# EasyEDA Pro project ChassisSupply_v1_0_2.eprj

# Schematic Schematic1
Board Name: Board1; Create Date: 2025-05-16; Page Name: P1; Project Name: ChassisSupply; Schematic Name: Schematic1; Update Date: 2025-05-17; Company: 嘉立创EDA; Drawed: 王大智; Page Size: A4; Version: V1.0
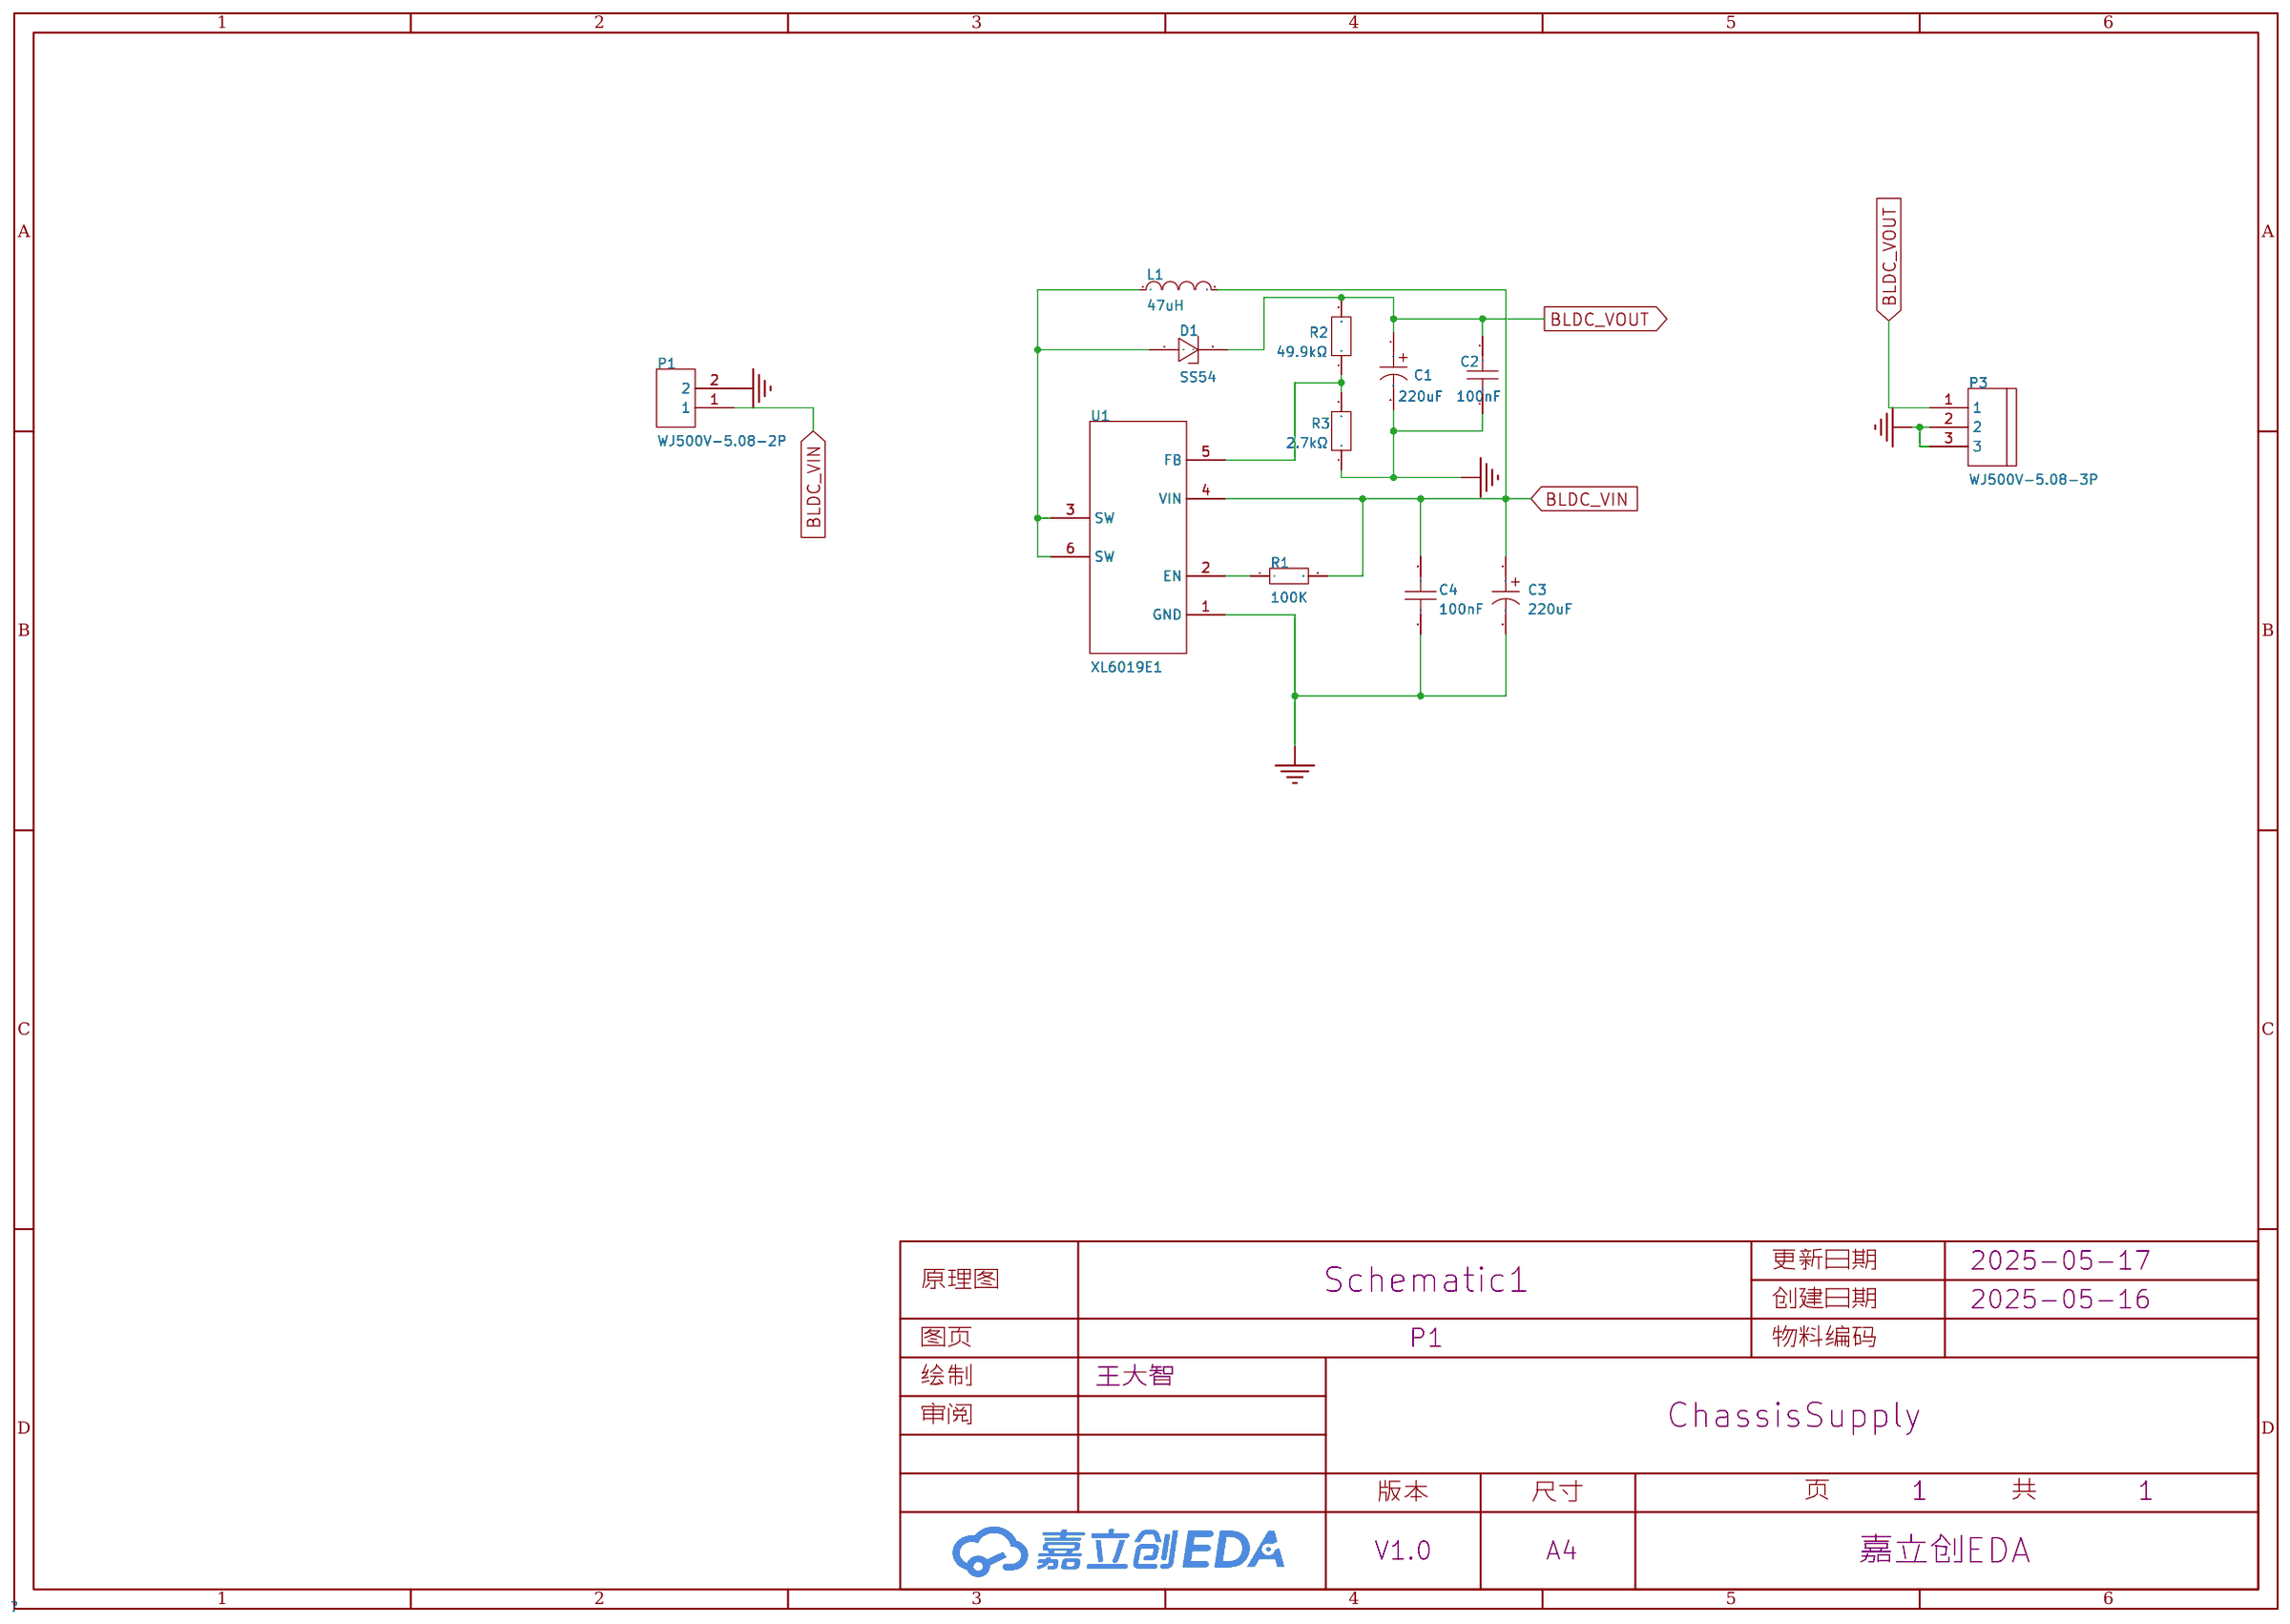
[diagram p0: schematic sheet]

## Parts
C1  220uF  [CAP-SMD_BD8.0-L8.3-W8.3-FD]
C2  100nF  [C0603]
C3  220uF  [CAP-SMD_BD8.0-L8.3-W8.3-FD]
C4  100nF  [C0603]
D1  SS54  [SMA_L4.3-W2.6-LS5.0-FD]
L1  47uH  [IND-SMD_L11.5-W10.0_SMMS1040]
P1  WJ500V-5.08-2P  [CONN-TH_2P-P5.00_WJ500V-5.08-2P]
P3  WJ500V-5.08-3P  [CONN-TH_3P-P5.00_WJ500V-5.08-3P]
R1  100K  [R0603]
R2  49.9kΩ  [R0603]
R3  2.7kΩ  [R0603]
U1  XL6019E1  [TO-263-5_L10.2-W9.9-P1.70-LS14.4-TL]

## Library data of the parts
C1 C3 = GVT1V227M0810CNVC: 容值:220uF;精度:±20%;额定电压:35V;纹波电流:175mA@120Hz;; LCSC Part Name: 220uF ±20% 35V; Supplier Part: C2983323; Manufacturer: HRK(鸿瑞凯电子); Supplier Footprint: SMD,D8xL10.5mm; JLCPCB Part Class: 扩展库; Datasheet: https://atta.szlcsc.com/upload/public/pdf/source/20220321/BA17E910A44EA2B508CDD6AB8BA576BA.pdf; Supplier: LCSC; Tolerance: ±20%; Rated Voltage: 35V; Ripple Current: 175mA@120Hz; φD: 8mm; L: 10.5mm; Lifetime @ Temp: 2000hrs@105℃; Operating Temperature: -55℃~+105℃
C2 C4 = CAP_0603: Supplier Footprint: 0603
D1 = SS54_C7420369: 二极管配置:独立式;正向压降(Vf):550mV@5.0A;直流反向耐压(Vr):40V;整流电流:5A;; LCSC Part Name: 电压:40V 电流:5A; Supplier Part: C7420369; Manufacturer: 宏迦橙; Supplier Footprint: SMA(DO-214AC); JLCPCB Part Class: 扩展库; Datasheet: https://atta.szlcsc.com/upload/public/pdf/source/20230828/254C3882F8647358AD9F60DD73611B5E.pdf; Supplier: LCSC; Diode Configuration: 独立式; Forward Voltage (Vf@If): 550mV@5.0A; Reverse Voltage (Vr): 40V; Rectified Current: 5A; Reverse Leakage Current (Ir): 50uA@40V
L1 = SMMS1040-470M: 电感值:47uH;精度:±20%;额定电流:3A;饱和电流(Isat):4.5A;类型:一体成型电感;; LCSC Part Name: 47uH ±20% 4.5A; Supplier Part: C149599; Manufacturer: SXN(顺翔诺); JLCPCB Part Class: 扩展库; Datasheet: https://atta.szlcsc.com/upload/public/pdf/source/20210810/BBF24330FB2F5029F637830BA9C42C0D.pdf; Supplier: LCSC; Tolerance: ±20%; Rated Current: 3A; Saturation Current (Isat): 4.5A; DC Resistance (DCR): 155mΩ; Type: 一体成型电感
P1 = WJ500V-5.08-2P: 结构:1x2P;间距:5.08mm;颜色:绿色;安装方式:直插;额定电流:18A;额定电压:250V;排数:1;线规 - AWG:14~30;线规 - 平方毫米:2.5;每排PIN数:2;触头材质:-;触头镀层:-;工作温度范围:-40℃~+105℃;焊接温度(最大值):-;; LCSC Part Name: 1x2P 5.08mm 直插 排数:1 每排P数:2; Supplier Part: C8465; Manufacturer: KANGNEX(康奈克斯电气); Supplier Footprint: 插件,P=5.08mm; JLCPCB Part Class: 扩展库; Datasheet: https://atta.szlcsc.com/upload/public/pdf/source/20191225/C8465_02D34CE5B5B4A53DF5891601D97FA9F4.pdf; Supplier: LCSC; Structure: 1x2P; Pitch: 5.08mm; Color: 绿色; Mounting Style: 直插; Current Rating (Max): 18A; Voltage Rating (Max): 250V; Number of Pins: 2P; Number of Rows: 1; Wire Gauge - AWG: 14~30; Wire Gauge - mm2: 2.5; Number of PINs Per Row: 2; Operating Temperature Range: -40℃~+105℃; Screw Specification: M2.5
P3 = WJ500V-5.08-3P: 结构:1x3P;间距:5.08mm;颜色:绿色;安装方式:直插;额定电流:18A;额定电压:250V;排数:1;线规 - AWG:14~30;线规 - 平方毫米:2.5;每排PIN数:3;工作温度范围:-40℃~+105℃;; LCSC Part Name: 5.08mm 1x3P 排数:1 每排P数:3 直插; Supplier Part: C72334; Manufacturer: KANGNEX(康奈克斯电气); Supplier Footprint: 插件,P=5.08mm; JLCPCB Part Class: 扩展库; Datasheet: https://atta.szlcsc.com/upload/public/pdf/source/20191225/C72334_8A5EF831D67650233B6B1E3F2BC06274.pdf; Supplier: LCSC; Structure: 1x3P; Pitch: 5.08mm; Color: 绿色; Mounting Style: 直插; Current Rating (Max): 18A; Voltage Rating (Max): 250V; Number of Pins: 3P; Number of Rows: 1; Wire Gauge - AWG: 14~30; Wire Gauge - mm2: 2.5; Number of PINs Per Row: 3; Operating Temperature Range: -40℃~+105℃
R1 = Res_0603: Supplier Footprint: 0603
R2 = FRC0603F4992TS: 电阻类型:厚膜电阻;阻值:49.9kΩ;精度:±1%;功率:100mW;最大工作电压:75V;温度系数:±100ppm/℃;; LCSC Part Name: 49.9kΩ ±1% 100mW 厚膜电阻; Supplier Part: C2930109; Manufacturer: FOJAN(富捷); Supplier Footprint: 0603; JLCPCB Part Class: 扩展库; Datasheet: https://atta.szlcsc.com/upload/public/pdf/source/20211221/925EC7D7225764EE0046F22065062C87.pdf; Supplier: LCSC; Type: 厚膜电阻; Tolerance: ±1%; Power(Watts): 100mW; Overload Voltage (Max): 75V; Temperature Coefficient: ±100ppm/℃; Operating Temperature Range: -55℃~+155℃
R3 = FRC0603F2701TS: 电阻类型:厚膜电阻;阻值:2.7kΩ;精度:±1%;功率:100mW;工作电压:75V;温度系数:±100ppm/℃;; LCSC Part Name: 2.7kΩ ±1% 100mW 厚膜电阻; Supplier Part: C2907008; Manufacturer: FOJAN(富捷); Supplier Footprint: 0603; JLCPCB Part Class: 扩展库; Datasheet: https://atta.szlcsc.com/upload/public/pdf/source/20211221/925EC7D7225764EE0046F22065062C87.pdf; Supplier: LCSC; Type: 厚膜电阻; Tolerance: ±1%; Power(Watts): 100mW; Voltage-Supply(Max): 75V; Temperature Coefficient: ±100ppm/℃; Operating Temperature: -55℃~+155℃
U1 = XL6019E1: 功能类型:升降压型;输出类型:可调;工作电压:5V~40V;输出电压:-;输出电流:5A;; LCSC Part Name: 180KHz 60V 5A开关电流升压/升降压型DC-DC转换器; Supplier Part: C73018; Manufacturer: XLSEMI(芯龙); Supplier Footprint: TO-263-5; JLCPCB Part Class: 扩展库; Datasheet: https://atta.szlcsc.com/upload/public/pdf/source/20230915/0F37A40A07D65557F92F701F29EBE038.pdf; Supplier: LCSC; Function: 升降压型; Output Type: 可调; Input Voltage: 5V~40V; Output Current: 5A; Switching Frequency: 180kHz; Operating Temperature: -40℃~+125℃; Synchronous Rectification: 是; Number of Outputs: 1; Topology: 反相式; Quiescent Current (Iq): 2.5mA; Switch tube (built-in/external): 内置

## Nets
GND: C1.2 C2.1 C3.2 C4.2 P1.2 P3.2 P3.3 R3.1 U1.1(GND)
BLDC_VIN: C3.1 C4.1 L1.2 P1.1 R1.2 U1.4(VIN)
BLDC_VOUT: C1.1 C2.2 D1.2(K) P3.1 R2.2
$1N575: R1.1 U1.2(EN)
$1N880: R2.1 R3.2 U1.5(FB)
$1N989: D1.1(A) L1.1 U1.3(SW) U1.6(SW)

# Board PCB1
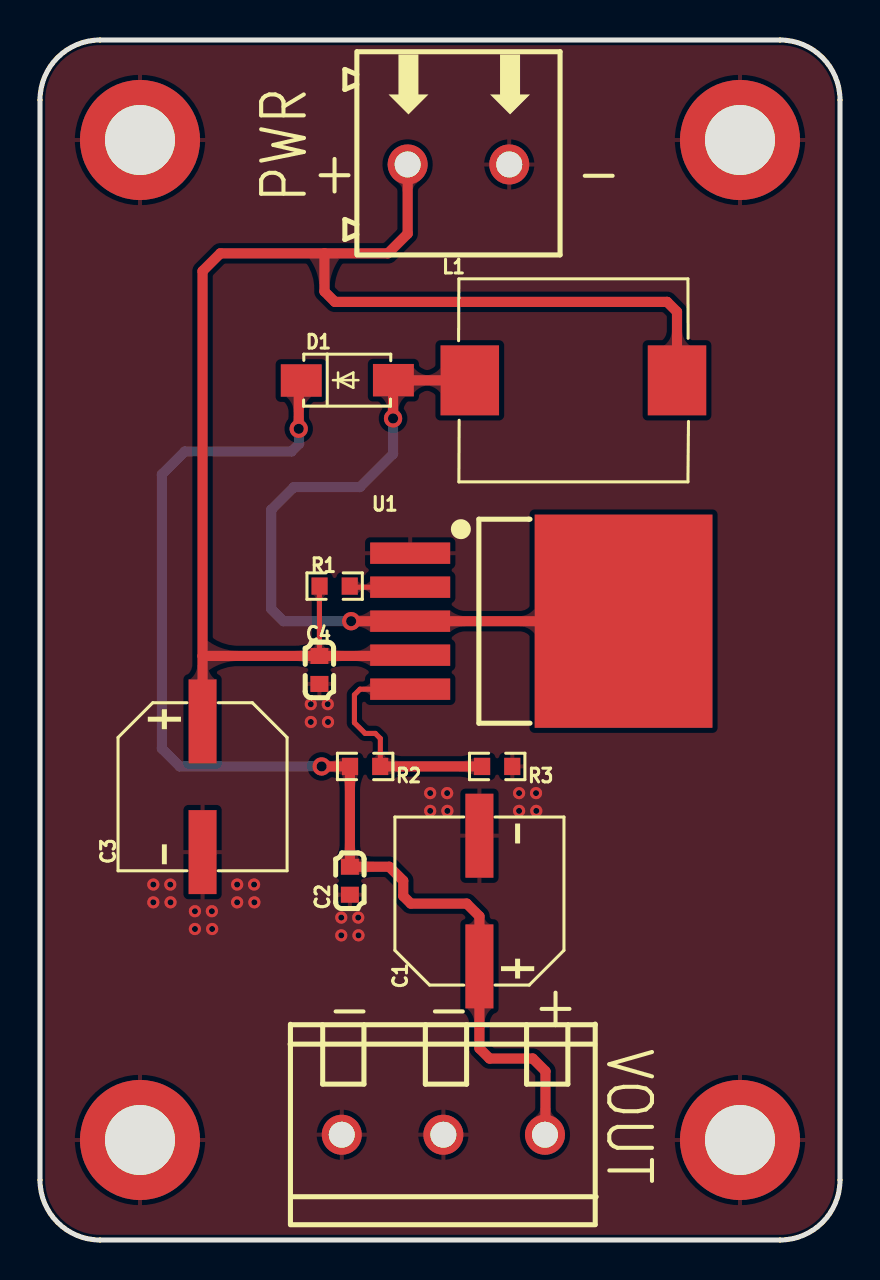
[diagram p1: board, top side]
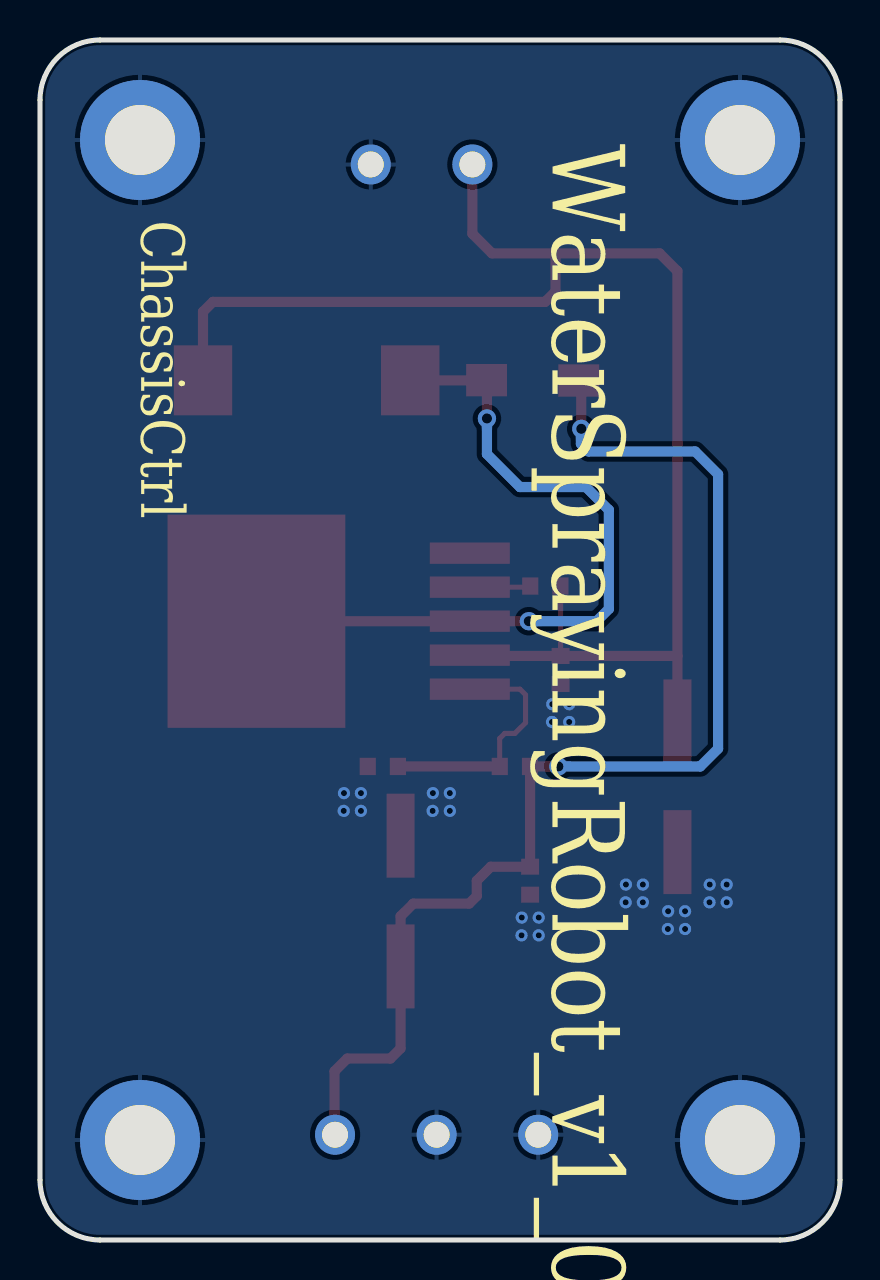
[diagram p2: board, bottom side, seen from below]

Outline 40 x 60 mm; copper layers: Top Layer, Bottom Layer. Coordinates in mm from the lower left corner of the outline.
Outline path: 0,57 0,3 arc(0.88,0.88) 3,0 37,0 arc(39.12,0.88) 40,3 40,57 arc(39.12,59.12) 37,60 3,60 arc(0.88,59.12) 0,57
Stack: Top Layer 0.035mm / Dielectric1 1.51mm FR4 er 4.5 / Bottom Layer 0.035mm

## Design rules (mm)
template: JLCPCB Capability(Two Layers Board)
spacing copperThickness1oz (default): track to track 0.102, other pairs 0.152 to 0.3
spacing copperThickness2oz: track to track 0.203, other pairs 0.152 to 0.3
track width copperThickness1oz (default): min 0.127, default 0.254, max 2.54
track width copperThickness2oz: min 0.203, default 0.254, max 2.54
differential pair differentialPair (default): width min 0.127, default 0.254, max 2.54; gap min 0.152, default 0.152
via viaSize (default): diameter min 0.5, default 0.61, max 10; hole min 0.3, default 0.305, max 6.3

## Placement (name value [footprint] x y rotation side)
C1  220uF  [CAP-SMD_BD8.0-L8.3-W8.3-FD]  21.97 16.95 90 top
C2  100nF  [C0603]  15.49 17.96 90 top
C3  220uF  [CAP-SMD_BD8.0-L8.3-W8.3-FD]  8.13 22.66 270 top
C4  100nF  [C0603]  13.97 28.5 270 top
D1  SS54  [SMA_L4.3-W2.6-LS5.0-FD]  15.37 42.98 180 top
L1  47uH  [IND-SMD_L11.5-W10.0_SMMS1040]  26.67 42.98 0 top
NOREF  -  [Pad_e26]  35 5 0 top
NOREF#2  -  [Pad_e13]  5 55 0 top
NOREF#3  -  [Pad_e25]  35 55 0 top
NOREF#4  -  [Pad_e17]  5 5 0 top
P1  WJ500V-5.08-2P  [CONN-TH_2P-P5.00_WJ500V-5.08-2P]  20.92 53.78 0 top
P3  WJ500V-5.08-3P  [CONN-TH_3P-P5.00_WJ500V-5.08-3P]  20.17 5.26 180 top
R1  100K  [R0603]  14.73 32.69 180 top
R2  49.9kΩ  [R0603]  16.26 23.68 180 top
R3  2.7kΩ  [R0603]  22.86 23.68 180 top
U1  XL6019E1  [TO-263-5_L10.2-W9.9-P1.70-LS14.4-TL]  23.84 30.94 0 top

## Footprints (pads in the part's own frame, mm; a bottom-side part is the same pattern mirrored in y, then rotated)
C0603
  rect 0.8x0.9 smd: 1(-0.7,0) 2(0.7,0)
CAP-SMD_BD8.0-L8.3-W8.3-FD
  rect 4.2x1.4 smd: 1(-3.267,0) 2(3.267,0)
CONN-TH_2P-P5.00_WJ500V-5.08-2P
  round 2 hole 1.3: 1(-2.54,0) 2(2.54,0)
CONN-TH_3P-P5.00_WJ500V-5.08-3P
  round 2 hole 1.3: 1(-5.08,0) 2(0,0) 3(5.08,0)
IND-SMD_L11.5-W10.0_SMMS1040
  rect 2.924x3.5 smd: 1(-5.181,0) 2(5.181,0)
Pad_e13
  round 6 hole 3.5: 1(0,0)
Pad_e17
  round 6 hole 3.5: 1(0,0)
Pad_e25
  round 6 hole 3.5: 1(0,0)
Pad_e26
  round 6 hole 3.5: 1(0,0)
R0603
  rect 0.806x0.864 smd: 1(-0.753,0) 2(0.753,0)
SMA_L4.3-W2.6-LS5.0-FD
  rect 2.046x1.62 smd: 1(-2.304,-0.009) 2(2.304,0.009)
TO-263-5_L10.2-W9.9-P1.70-LS14.4-TL
  rect 4x1.069 smd: 1(-5.334,3.4) 2(-5.334,1.7) 3(-5.334,0) 4(-5.334,-1.7) 5(-5.334,-3.4)
  rect 8.89x10.66 smd: 6(5.334,0)

## Nets
As in the schematic, except:
GND: C1.2 C2.1 C3.2 C4.2 NOREF.1 NOREF#2.1 NOREF#3.1 NOREF#4.1 P1.2 P3.2 P3.3 R3.1 U1.1

## Via types
v1: diameter 0.914, hole 0.508, Top Layer to Bottom Layer, 4 vias
v2: diameter 0.61, hole 0.305, Top Layer to Bottom Layer, 28 vias

## Routing (per net, layer and track width the routed paths; a pad name or vN(x,y) marks a point on that pad's centre or on a via; arc(x,y) is an arc through that point)
GND:
  vias: v2(5.67,17.77) v2(5.67,16.88) v2(6.51,17.77) v2(6.53,16.88) v2(7.75,16.44) v2(7.75,15.55) v2(8.59,16.44) v2(8.61,15.55) v2(9.86,17.77) v2(9.86,16.88) v2(10.7,17.77) v2(10.72,16.88) v2(13.54,26.79) v2(13.54,25.9) v2(14.39,26.79) v2(14.4,25.9) v2(15.06,16.12) v2(15.06,15.23) v2(15.91,16.12) v2(15.92,15.23) v2(19.51,22.34) v2(19.51,21.46) v2(20.36,22.34) v2(20.37,21.46) v2(23.95,22.34) v2(23.95,21.46) v2(24.8,22.34) v2(24.81,21.46)
BLDC_VIN: length 74.3
  Top Layer w0.254: R1.2 13.97,32.69 C4.1
  Top Layer w0.508: 8.13,29.2 C3.1 ; 8.13,29.2 8.13,48.44 9.02,49.33 14.21,49.33 ; 8.13,29.2 C4.1 18.47,29.2 U1.4 ; P1.1 18.38,50.32 17.4,49.33 14.21,49.33 ; 14.21,49.33 14.22,49.32 14.22,47.43 14.75,46.91 31.36,46.91 31.85,46.41 L1.2
BLDC_VOUT: length 60.7
  Top Layer w0.508: v1(14.08,23.68) R2.2 15.49,23.67 C2.2 17.46,18.66 18.16,17.96 18.16,17.2 18.54,16.82 21.34,16.82 21.97,16.19 C1.1 21.97,9.58 22.48,9.07 24.64,9.07 25.27,8.44 25.27,5.29 P3.1 ; D1.2 12.94,42.85 v1(12.94,40.56)
  Bottom Layer w0.508: v1(12.94,40.56) 12.95,40.54 12.95,39.81 12.57,39.43 7.24,39.43 6.1,38.28 6.1,24.57 6.99,23.68 v1(14.08,23.68)
$1N575: length 3
  Top Layer w0.254: U1.2 15.54,32.64 R1.1
$1N880: length 12.4
  Top Layer w0.254: U1.5 16,27.54 15.72,27.26 15.72,25.86 16.26,25.33 16.76,25.33 17.02,25.08 17.02,23.69 R2.1
  Top Layer w0.508: R2.1 R3.2
$1N989: length 37.6
  Top Layer w0.508: U1.6 U1.3 v1(15.56,30.94) ; L1.1 17.68,42.98 D1.1 17.65,42.97 v1(17.65,41.08)
  Bottom Layer w0.508: v1(17.65,41.08) 17.65,39.3 16,37.65 12.7,37.65 11.56,36.5 11.56,31.55 12.17,30.94 v1(15.56,30.94)

## Copper pours and planes (outline as drawn; the poured copper is in the pictures)
GND on Top Layer: -3.17,63.81 44.32,63.81 44.32,-7.06 -3.17,-7.06
GND on Bottom Layer: -3.68,63.3 47.24,63.3 47.24,-10.99 -3.68,-10.99

Small or netless copper shapes (teardrops, artwork), in the pictures only: 34 on Top Layer, 4 on Bottom Layer

## Text on the board
Bottom Silkscreen Layer: ChassisCtrl | WaterSprayingRobot_v1_0_2
Top Silkscreen Layer: + | - | PWR | VOUT
